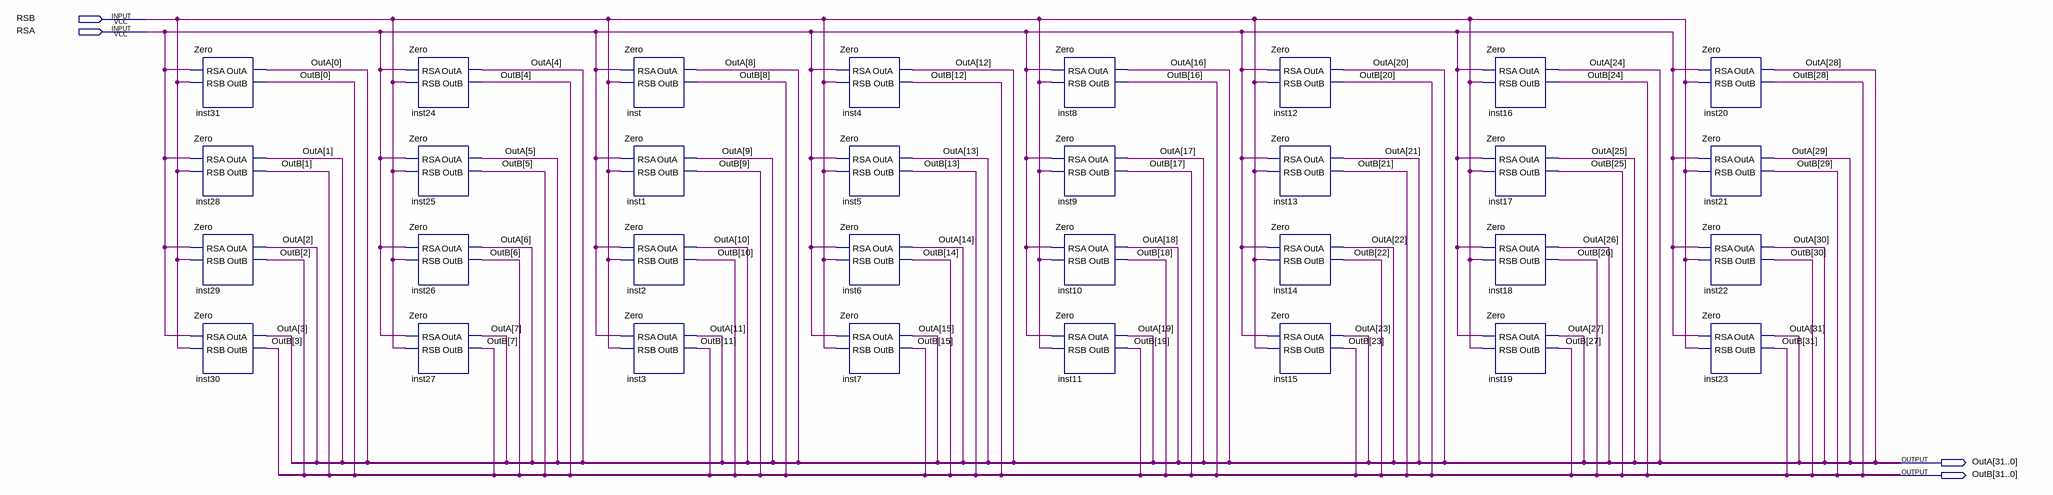
[diagram p0: schematic sheet]
// Quartus schematic Zero32.bdf as structural Verilog: 32 symbols, 4 pins
module Zero32 (
  input  RSB,
  input  RSA,
  output [31:0] OutA,
  output [31:0] OutB
);

  Zero inst31 (.RSA(RSA), .RSB(RSB), .OutA(OutA[0]), .OutB(OutB[0]));
  Zero inst28 (.RSA(RSA), .RSB(RSB), .OutA(OutA[1]), .OutB(OutB[1]));
  Zero inst29 (.RSA(RSA), .RSB(RSB), .OutA(OutA[2]), .OutB(OutB[2]));
  Zero inst30 (.RSA(RSA), .RSB(RSB), .OutA(OutA[3]), .OutB(OutB[3]));
  Zero inst24 (.RSA(RSA), .RSB(RSB), .OutA(OutA[4]), .OutB(OutB[4]));
  Zero inst25 (.RSA(RSA), .RSB(RSB), .OutA(OutA[5]), .OutB(OutB[5]));
  Zero inst26 (.RSA(RSA), .RSB(RSB), .OutA(OutA[6]), .OutB(OutB[6]));
  Zero inst27 (.RSA(RSA), .RSB(RSB), .OutA(OutA[7]), .OutB(OutB[7]));
  Zero inst (.RSA(RSA), .RSB(RSB), .OutA(OutA[8]), .OutB(OutB[8]));
  Zero inst1 (.RSA(RSA), .RSB(RSB), .OutA(OutA[9]), .OutB(OutB[9]));
  Zero inst2 (.RSA(RSA), .RSB(RSB), .OutA(OutA[10]), .OutB(OutB[10]));
  Zero inst3 (.RSA(RSA), .RSB(RSB), .OutA(OutA[11]), .OutB(OutB[11]));
  Zero inst4 (.RSA(RSA), .RSB(RSB), .OutA(OutA[12]), .OutB(OutB[12]));
  Zero inst5 (.RSA(RSA), .RSB(RSB), .OutA(OutA[13]), .OutB(OutB[13]));
  Zero inst6 (.RSA(RSA), .RSB(RSB), .OutA(OutA[14]), .OutB(OutB[14]));
  Zero inst7 (.RSA(RSA), .RSB(RSB), .OutA(OutA[15]), .OutB(OutB[15]));
  Zero inst8 (.RSA(RSA), .RSB(RSB), .OutA(OutA[16]), .OutB(OutB[16]));
  Zero inst9 (.RSA(RSA), .RSB(RSB), .OutA(OutA[17]), .OutB(OutB[17]));
  Zero inst10 (.RSA(RSA), .RSB(RSB), .OutA(OutA[18]), .OutB(OutB[18]));
  Zero inst11 (.RSA(RSA), .RSB(RSB), .OutA(OutA[19]), .OutB(OutB[19]));
  Zero inst12 (.RSA(RSA), .RSB(RSB), .OutA(OutA[20]), .OutB(OutB[20]));
  Zero inst13 (.RSA(RSA), .RSB(RSB), .OutA(OutA[21]), .OutB(OutB[21]));
  Zero inst14 (.RSA(RSA), .RSB(RSB), .OutA(OutA[22]), .OutB(OutB[22]));
  Zero inst15 (.RSA(RSA), .RSB(RSB), .OutA(OutA[23]), .OutB(OutB[23]));
  Zero inst16 (.RSA(RSA), .RSB(RSB), .OutA(OutA[24]), .OutB(OutB[24]));
  Zero inst17 (.RSA(RSA), .RSB(RSB), .OutA(OutA[25]), .OutB(OutB[25]));
  Zero inst18 (.RSA(RSA), .RSB(RSB), .OutA(OutA[26]), .OutB(OutB[26]));
  Zero inst19 (.RSA(RSA), .RSB(RSB), .OutA(OutA[27]), .OutB(OutB[27]));
  Zero inst20 (.RSA(RSA), .RSB(RSB), .OutA(OutA[28]), .OutB(OutB[28]));
  Zero inst21 (.RSA(RSA), .RSB(RSB), .OutA(OutA[29]), .OutB(OutB[29]));
  Zero inst22 (.RSA(RSA), .RSB(RSB), .OutA(OutA[30]), .OutB(OutB[30]));
  Zero inst23 (.RSA(RSA), .RSB(RSB), .OutA(OutA[31]), .OutB(OutB[31]));
endmodule
